# EAGLE design zloshnik2 (EAGLE 6.1)
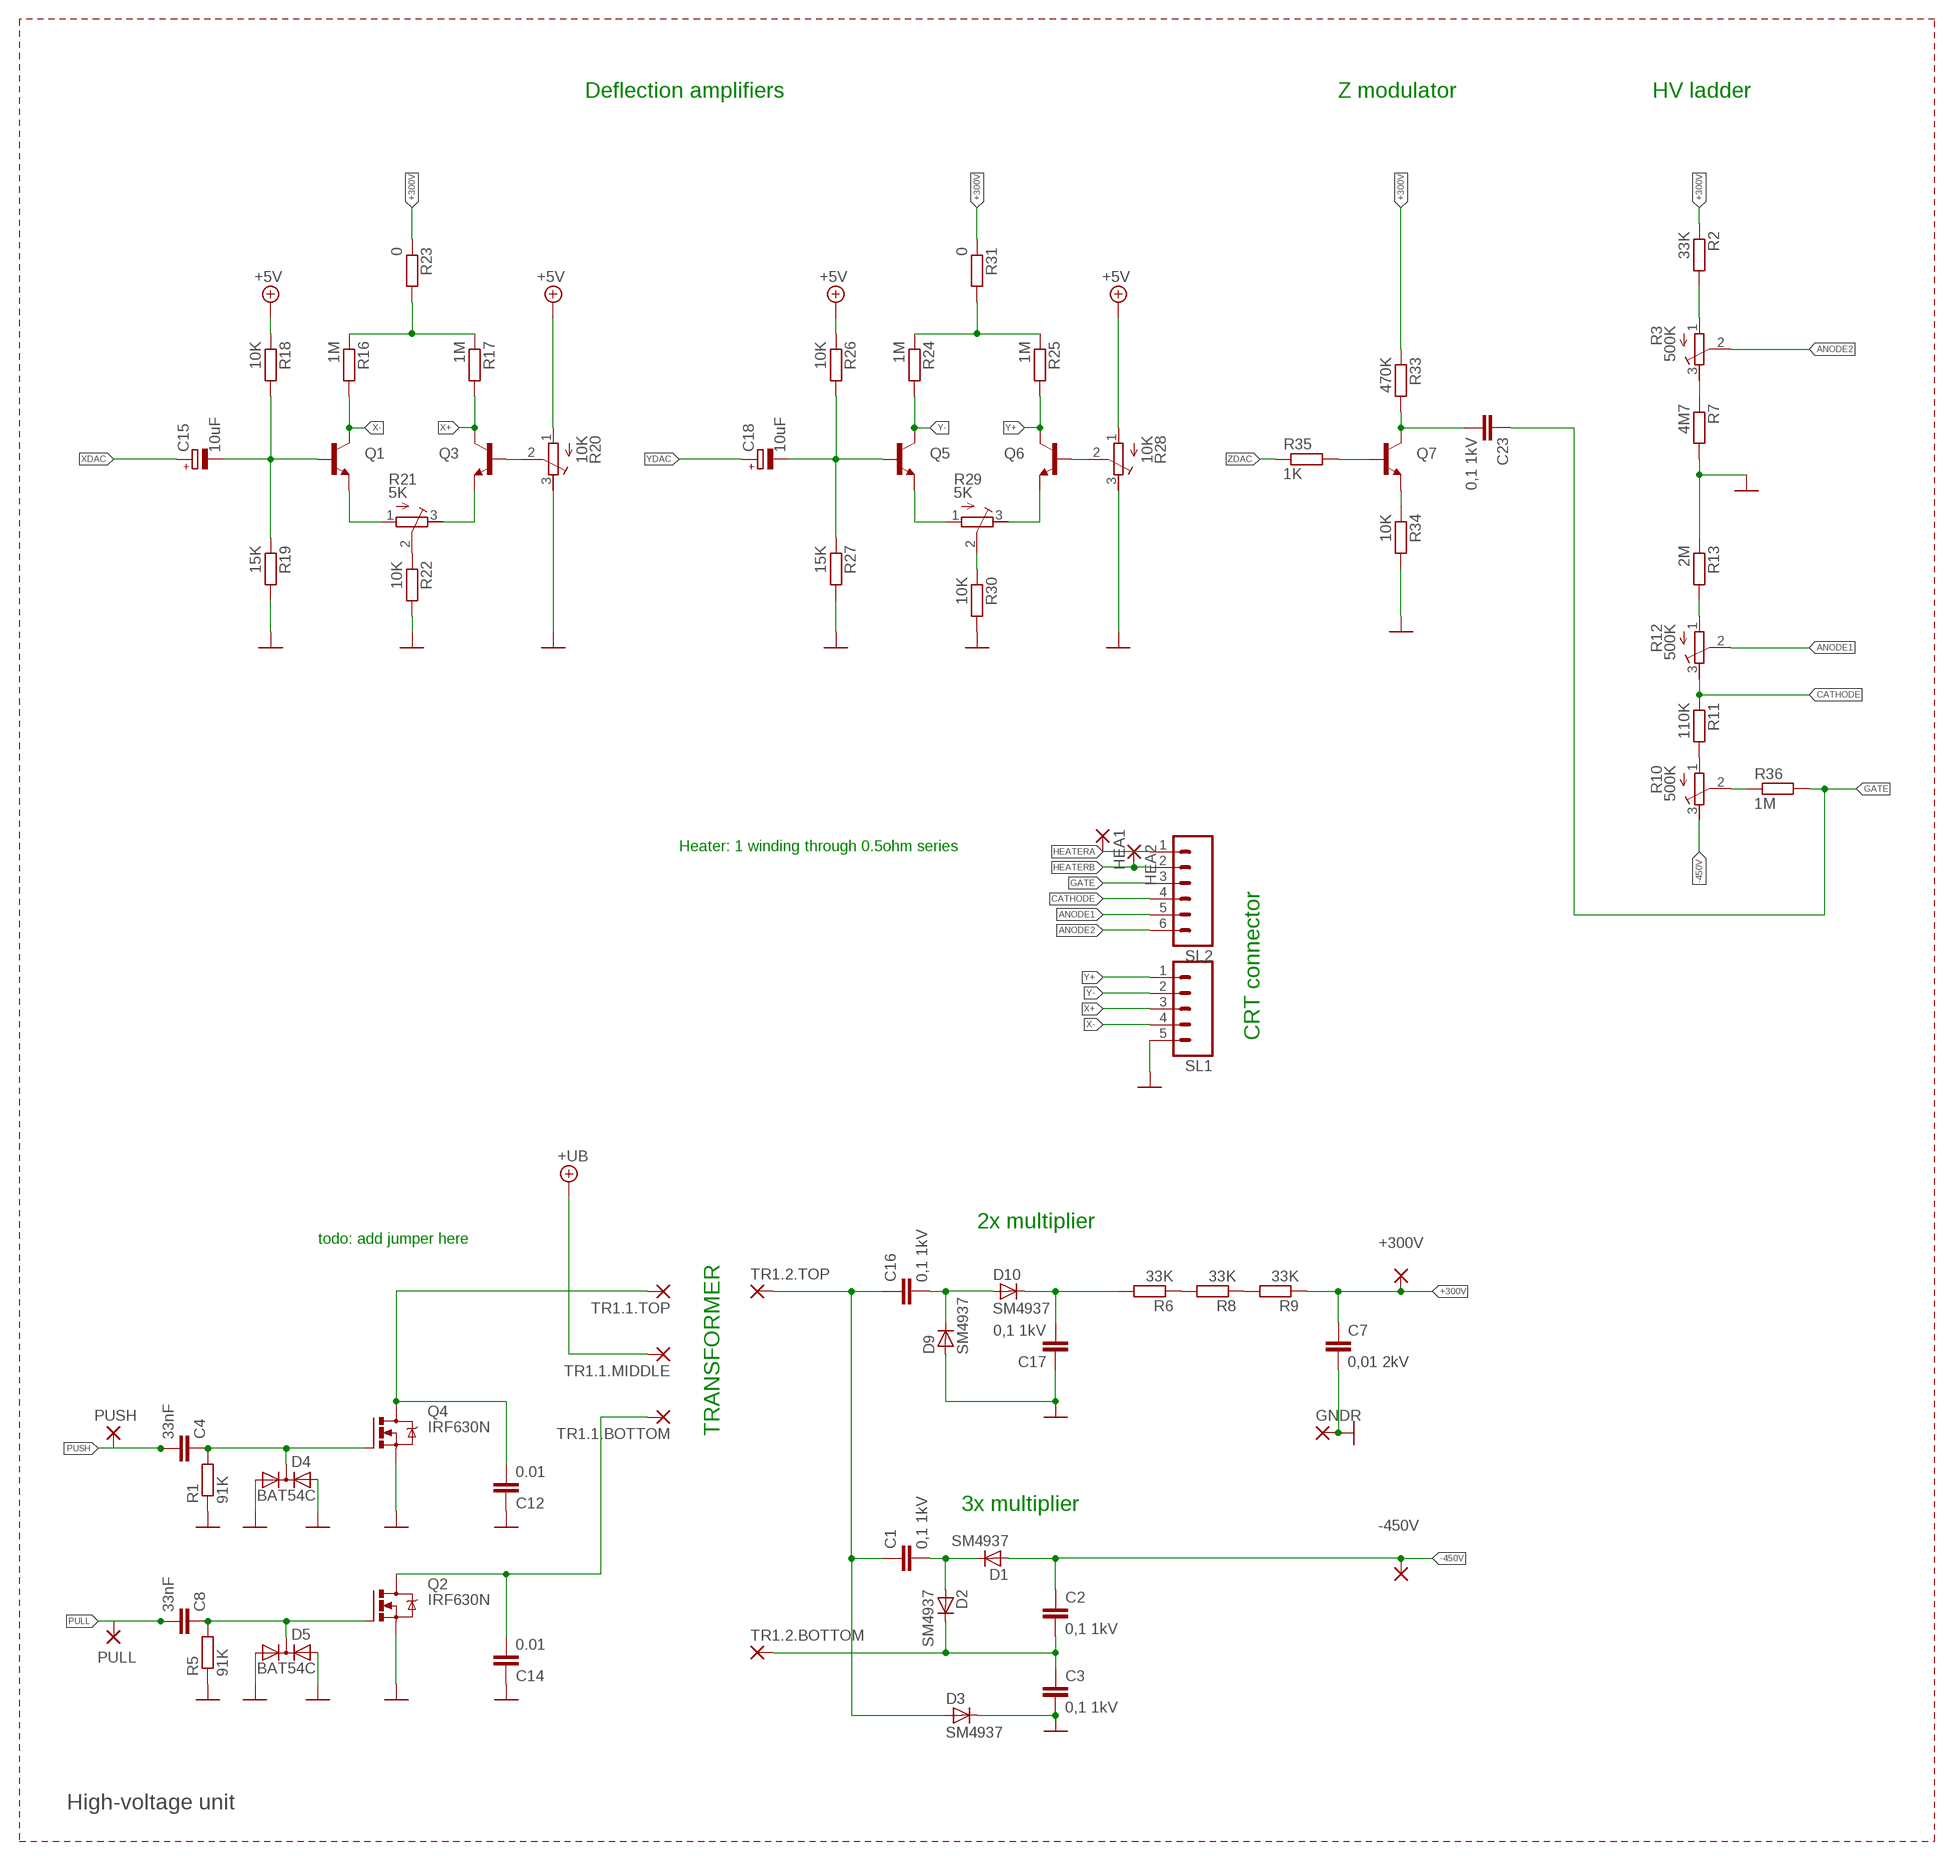
[diagram p0: schematic, sheet 1, part 1 of 2]
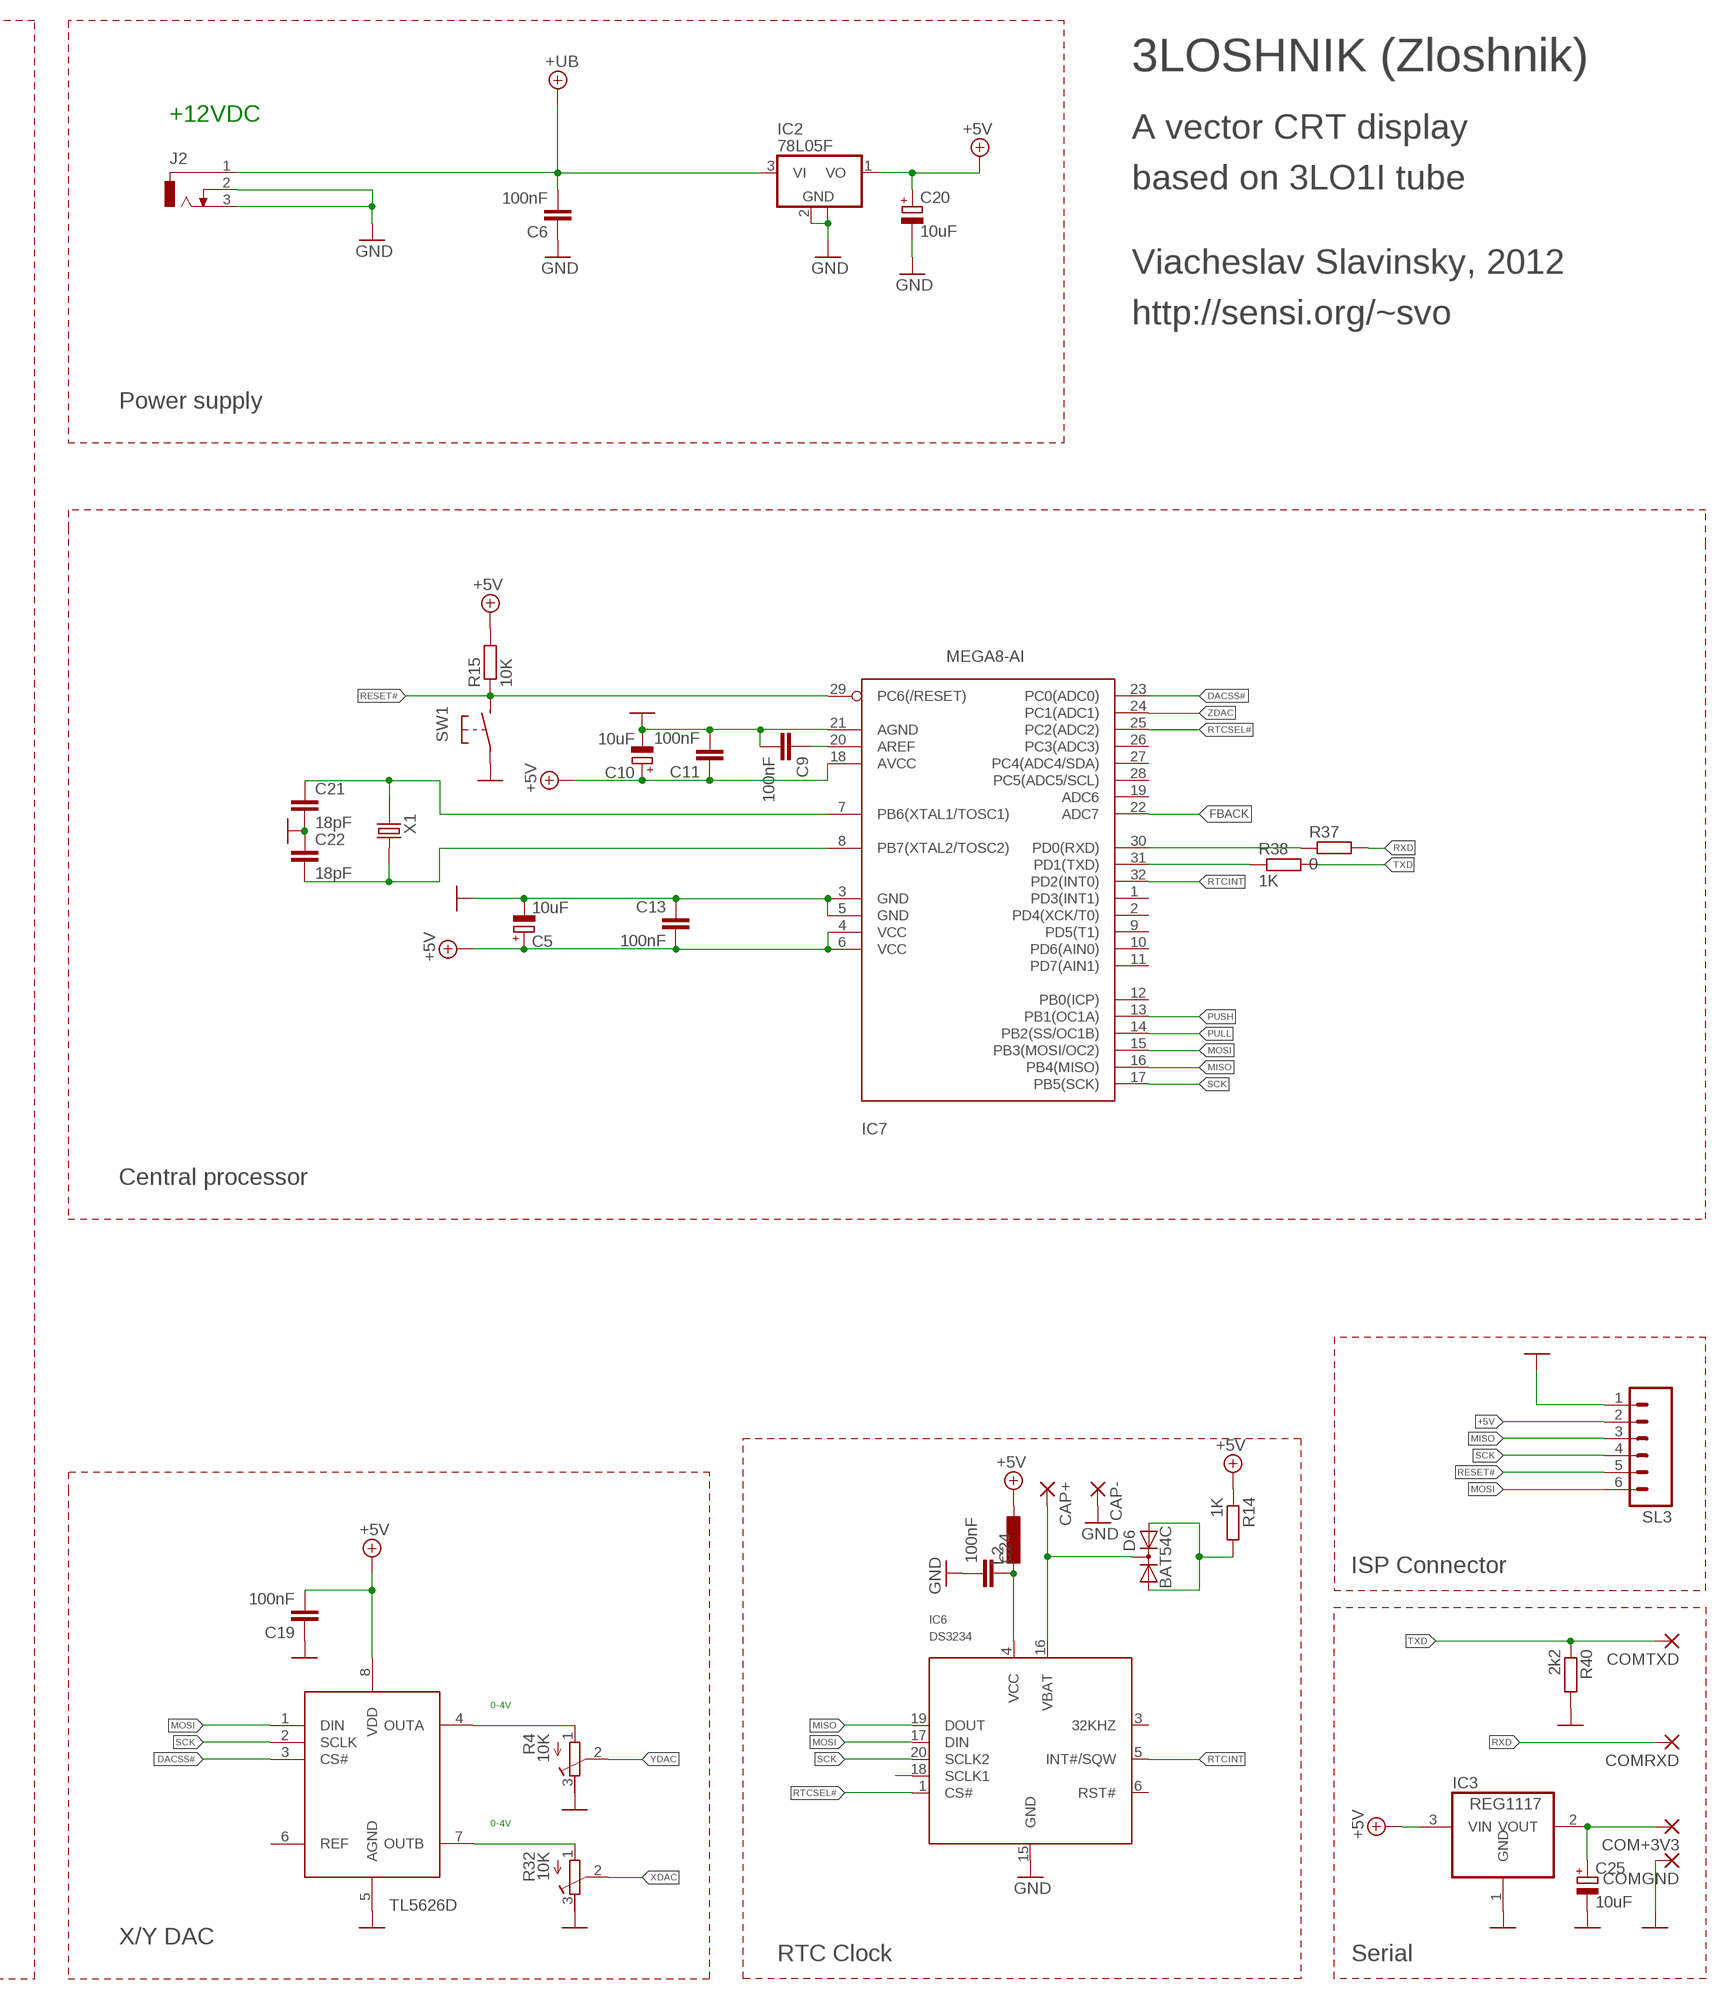
[diagram p1: schematic, sheet 1, part 2 of 2]

## Parts
+300V  1,6/0,8  [1,6/0,8]
-450V  1,6/0,8  [1,6/0,8]
C1  0,1 1kV  C-EUC2220K  [C2220K]
C2  0,1 1kV  C-EUC2220K  [C2220K]
C3  0,1 1kV  C-EUC2220K  [C2220K]
C4  33nF  C-EUC0805S  [C0805S]
C5  10uF  CPOL-EUSMCB  [SMC_B]
C6  100nF  C-EUC0603K  [C0603K]
C7  0,01 2kV  C-EUC1812  [C1812]
C8  33nF  C-EUC0805S  [C0805S]
C9  100nF  C-EUC0603K  [C0603K]
C10  10uF  CPOL-EUSMCB  [SMC_B]
C11  100nF  C-EUC0603K  [C0603K]
C12  0.01  C-EUC0805S  [C0805S]
C13  100nF  C-EUC0603K  [C0603K]
C14  0.01  C-EUC0805S  [C0805S]
C15  10uF  CPOL-EUSMCB  [SMC_B]
C16  0,1 1kV  C-EUC2220K  [C2220K]
C17  0,1 1kV  C-EUC2220K  [C2220K]
C18  10uF  CPOL-EUSMCB  [SMC_B]
C19  100nF  C-EUC0603K  [C0603K]
C20  10uF  CPOL-EUSMCB  [SMC_B]
C21  18pF  C-EUC0805S  [C0805S]
C22  18pF  C-EUC0805S  [C0805S]
C23  0,1 1kV  C-EUC2220K  [C2220K]
C24  100nF  C-EUC0603K  [C0603K]
C25  10uF  CPOL-EUSMCB  [SMC_B]
CAP+  2,54/0,8  [2,54/0,8]
CAP-  2,54/0,8  [2,54/0,8]
COM+3V3  1,6/0,8  [1,6/0,8]
COMGND  1,6/0,8  [1,6/0,8]
COMRXD  1,6/0,8  [1,6/0,8]
COMTXD  1,6/0,8  [1,6/0,8]
D1  SM4937  D-SOD-87  [SOD87]
D2  SM4937  D-SOD-87  [SOD87]
D3  SM4937  D-SOD-87  [SOD87]
D4  BAT54C  DIODE-2AC|CASOT23  [SOT23]
D5  BAT54C  DIODE-2AC|CASOT23  [SOT23]
D6  BAT54C  DIODE-2AC|CASOT23  [SOT23]
D9  SM4937  D-SOD-87  [SOD87]
D10  SM4937  D-SOD-87  [SOD87]
GNDR  1,6/0,8  [1,6/0,8]
HEA1  1,6/0,8  [1,6/0,8]
HEA2  1,6/0,8  [1,6/0,8]
IC1  TLV5626D  TL5626D  [SO08]
IC2  78L05F  [SOT89]
IC3  REG1117  [SOT223]
IC6  DS3234  [SO-20DW]
IC7  MEGA8-AI  [TQFP32-08]
J2  DCJ-SMALL  [DCJ-SMALL]
L2  L-EUL3230M  [L3230M]
PULL  1,6/0,8  [1,6/0,8]
PUSH  1,6/0,8  [1,6/0,8]
Q1  TRANSISTOR_NPNSOT23-3  [SOT23-3]
Q2  IRF630N  IRF740  [TO220BV]
Q3  TRANSISTOR_NPNSOT23-3  [SOT23-3]
Q4  IRF630N  IRF740  [TO220BV]
Q5  TRANSISTOR_NPNSOT23-3  [SOT23-3]
Q6  TRANSISTOR_NPNSOT23-3  [SOT23-3]
Q7  TRANSISTOR_NPNSOT23-3  [SOT23-3]
R1  91K  R-EU_R0805S  [R0805-SVO]
R2  33K  R-EU_R0805S  [R0805-SVO]
R3  500K  R-TRIMM4G/J  [RTRIM4G/J]
R4  10K  R-TRIMM4G/J  [RTRIM4G/J]
R5  91K  R-EU_R0805S  [R0805-SVO]
R6  33K  R-EU_R0805S  [R0805-SVO]
R7  4M7  R-EU_R0805S  [R0805-SVO]
R8  33K  R-EU_R0805S  [R0805-SVO]
R9  33K  R-EU_R0805S  [R0805-SVO]
R10  500K  R-TRIMM4G/J  [RTRIM4G/J]
R11  110K  R-EU_R0805S  [R0805-SVO]
R12  500K  R-TRIMM4G/J  [RTRIM4G/J]
R13  2M  R-EU_R0805S  [R0805-SVO]
R14  1K  R-EU_R0805S  [R0805-SVO]
R15  10K  R-EU_R0805S  [R0805-SVO]
R16  1M  R-EU_R0805S  [R0805-SVO]
R17  1M  R-EU_R0805S  [R0805-SVO]
R18  10K  R-EU_R0805S  [R0805-SVO]
R19  15K  R-EU_R0805S  [R0805-SVO]
R20  10K  R-TRIMM4G/J  [RTRIM4G/J]
R21  5K  R-TRIMM4G/J  [RTRIM4G/J]
R22  10K  R-EU_R0805S  [R0805-SVO]
R23  0  R-EU_R0805S  [R0805-SVO]
R24  1M  R-EU_R0805S  [R0805-SVO]
R25  1M  R-EU_R0805S  [R0805-SVO]
R26  10K  R-EU_R0805S  [R0805-SVO]
R27  15K  R-EU_R0805S  [R0805-SVO]
R28  10K  R-TRIMM4G/J  [RTRIM4G/J]
R29  5K  R-TRIMM4G/J  [RTRIM4G/J]
R30  10K  R-EU_R0805S  [R0805-SVO]
R31  0  R-EU_R0805S  [R0805-SVO]
R32  10K  R-TRIMM4G/J  [RTRIM4G/J]
R33  470K  R-EU_R0805S  [R0805-SVO]
R34  10K  R-EU_R0805S  [R0805-SVO]
R35  1K  R-EU_R0805S  [R0805-SVO]
R36  1M  R-EU_R0805S  [R0805-SVO]
R37  0  R-EU_R0805S  [R0805-SVO]
R38  1K  R-EU_R0805S  [R0805-SVO]
R40  2k2  R-EU_R0805S  [R0805-SVO]
SL1  M05  [05P]
SL2  M06  [06P]
SL3  M06  [06P]
SW1  BUTTON-IT_1181  [SW_IT1181]
TR1.1.BOTTOM  1,6/0,8  [1,6/0,8]
TR1.1.MIDDLE  1,6/0,8  [1,6/0,8]
TR1.1.TOP  1,6/0,8  [1,6/0,8]
TR1.2.BOTTOM  1,6/0,8  [1,6/0,8]
TR1.2.TOP  1,6/0,8  [1,6/0,8]
X1  XTAL0532  [XTAL_0532]

## Nets
+3V3: C25.+ COM+3V3.1(P) IC3.2(VOUT)
+5V: C5.+ C10.+ C11.1 C13.2 C19.2 C20.+ IC1.8(VDD) IC2.1(VO) IC3.3(VIN) IC7.4(VCC) IC7.6(VCC) IC7.18(AVCC) L2.1 R14.1 R15.2 R18.1 R20.1(E) R26.1 R28.1(E) SL3.2
+300V [hv250]: +300V.1(P) C7.1 R2.1 R9.1 R23.1 R31.1 R33.1
+UB [12v]: C6.2 IC2.3(VI) J2.1 TR1.1.MIDDLE.1(P)
-450V [hv800]: -450V.1(P) C2.1 D1.2(A) R10.3(A)
AC_A [hv800]: C1.1 C16.1 D3.2(A) TR1.2.TOP.1(P)
AC_B [hv800]: C2.2 C3.1 D2.1(C) TR1.2.BOTTOM.1(P)
ANODE1 [hv800]: R12.2(S) SL2.5
ANODE2 [hv800]: R3.2(S) SL2.6
CATHODE [hv800]: R11.1 R12.3(A) SL2.4
DACSS#: IC1.3(CS#) IC7.23(PC0(ADC0))
FBACK: IC7.22(ADC7)
GATE [hv800]: C23.1 R36.2 SL2.3
GND: C3.2 C5.- C6.1 C7.2 C9.2 C10.- C11.2 C12.1 C13.1 C14.1 C17.1 C19.1 C20.- C21.2 C22.1 C24.2 C25.- CAP-.1(P) COMGND.1(P) D3.1(C) D4.1(A1) D4.2(A2) D5.1(A1) D5.2(A2) D9.2(A) GNDR.1(P) IC1.5(AGND) IC2.2(GND) IC2.2@1(GND) IC3.1(GND) IC6.15(GND) IC7.3(GND) IC7.5(GND) IC7.21(AGND) J2.2 J2.3 Q2.S Q4.S R1.1 R4.3(A) R5.1 R7.2 R13.1 R19.2 R20.3(A) R22.2 R27.2 R28.3(A) R30.2 R32.3(A) R34.2 R40.2 SL1.5 SL3.1 SW1.P$1(P1)
HEATERA [hv800]: HEA1.1(P) SL2.1
HEATERB [hv800]: HEA2.1(P) SL2.2
HV+300UNF [hv800]: C17.2 D10.1(C) R6.2
HVN$3 [hv800]: C1.2 D1.1(C) D2.2(A)
HVN$6 [hv800]: C16.2 D9.1(C) D10.2(A)
HVN$17: R21.2(S) R22.1
HVN$18: Q1.2(E) R21.1(E)
HVN$19: Q3.2(E) R21.3(A)
HVN$21: R29.2(S) R30.1
HVN$22: R16.1 R17.1 R23.2
HVN$25: Q5.2(E) R29.1(E)
HVN$26: Q6.2(E) R29.3(A)
HVN$27: R24.1 R25.1 R31.2
MISO: IC6.19(DOUT) IC7.16(PB4(MISO)) SL3.3
MOSI: IC1.1(DIN) IC6.17(DIN) IC7.15(PB3(MOSI/OC2)) SL3.6
N$1 [hv800]: R2.2 R3.1(E)
N$2: IC6.18(SCLK1)
N$4: C4.1 D4.3(C) Q4.G R1.2
N$5: CAP+.1(P) D6.3(C) IC6.16(VBAT)
N$6 [hv800]: R3.3(A) R7.1
N$7: C8.1 D5.3(C) Q2.G R5.2
N$8: IC7.30(PD0(RXD)) R37.1
N$9 [hv800]: R12.1(E) R13.2
N$10: D6.1(A1) D6.2(A2) R14.2
N$12 [hv800]: R10.1(E) R11.2
N$14: C9.1 IC7.20(AREF)
N$20: IC7.31(PD1(TXD)) R38.1
N$23: Q3.1(B) R20.2(S)
N$24: C15.- Q1.1(B) R18.2 R19.1
N$28: Q6.1(B) R28.2(S)
N$29: C18.- Q5.1(B) R26.2 R27.1
N$30: C21.1 IC7.7(PB6(XTAL1/TOSC1)) X1.2
N$31: IC1.4(OUTA) R4.1(E)
N$32: IC1.7(OUTB) R32.1(E)
N$33: C22.2 IC7.8(PB7(XTAL2/TOSC2)) X1.4
N$34 [hv250]: C23.2 Q7.3(C) R33.2
N$35: Q7.2(E) R34.1
N$37 [hv800]: R10.2(S) R36.1
NVN$9 [hv800]: R8.1 R9.2
NVN$11 [hv800]: R6.1 R8.2
PULL: C8.2 IC7.14(PB2(SS/OC1B)) PULL.1(P)
PUSH: C4.2 IC7.13(PB1(OC1A)) PUSH.1(P)
RESET#: IC7.29(PC6(/RESET)) R15.1 SL3.5 SW1.P$2(P2)
RTCINT: IC6.5(INT#/SQW) IC7.32(PD2(INT0))
RTCSEL#: IC6.1(CS#) IC7.25(PC2(ADC2))
RTCVCC: C24.1 IC6.4(VCC) L2.2
RXD: COMRXD.1(P) R37.2
SCK: IC1.2(SCLK) IC6.20(SCLK2) IC7.17(PB5(SCK)) SL3.4
SW_LOW_A: C14.2 Q2.D TR1.1.BOTTOM.1(P)
SW_LOW_B: C12.2 Q4.D TR1.1.TOP.1(P)
TXD: COMTXD.1(P) R38.2 R40.1
X+ [hv250]: Q3.3(C) R17.2 SL1.3
X- [hv250]: Q1.3(C) R16.2 SL1.4
XDAC: C15.+ R32.2(S)
Y+ [hv250]: Q6.3(C) R25.2 SL1.1
Y- [hv250]: Q5.3(C) R24.2 SL1.2
YDAC: C18.+ R4.2(S)
ZDAC: IC7.24(PC1(ADC1)) R35.1
ZDACN$36: Q7.1(B) R35.2
Unconnected: IC1.6(REF) IC6.3(32KHZ) IC6.6(RST#) IC7.1(PD3(INT1)) IC7.2(PD4(XCK/T0)) IC7.9(PD5(T1)) IC7.10(PD6(AIN0)) IC7.11(PD7(AIN1)) IC7.12(PB0(ICP)) IC7.19(ADC6) IC7.26(PC3(ADC3)) IC7.27(PC4(ADC4/SDA)) IC7.28(PC5(ADC5/SCL))

## Notes on the sheet
- 3LOSHNIK (Zloshnik)
- Deflection amplifiers | Z modulator | HV ladder
- +12VDC
- A vector CRT display
- based on 3LO1I tube
- Viacheslav Slavinsky, 2012
- http://sensi.org/~svo
- Power supply
- Heater: 1 winding through 0.5ohm series
- CRT connector
- Central processor
- 2x multiplier
- todo: add jumper here
- TRANSFORMER
- ISP Connector
- 3x multiplier
- 0-4V
- 0-4V
- TL5626D
- High-voltage unit | X/Y DAC
- RTC Clock | Serial

## Library data of the parts
+300V -450V COM+3V3 COMGND COMRXD COMTXD GNDR HEA1 HEA2 PULL PUSH TR1.1.BOTTOM TR1.1.MIDDLE TR1.1.TOP TR1.2.BOTTOM TR1.2.TOP = wirepad:1,6/0,8: THROUGH-HOLE PAD
C1-C3 C7 C16 C17 C23 = 0-rcl:C-EU: CAPACITOR, European symbol
C4 C6 C8 C9 C11-C14 C19 C21 C22 C24 = rcl:C-EU: CAPACITOR, European symbol
C5 C10 C15 C18 C20 C25 = rcl:CPOL-EU: POLARIZED CAPACITOR, European symbol
CAP+ CAP- = wirepad:2,54/0,8: THROUGH-HOLE PAD
D1-D3 D9 D10 = semicon-smd-ipc:D-: DIODE unfilled
D4-D6 = diode:DIODE-2AC|CA: Dual DIODE Anode-Cathode|Cathode-Anode
IC1 = 0-tlv5626:TL5626*: 2.7-V TO 5.5-V LOW-POWER DUAL 8-BIT DIGITAL-TO-ANALOG CONVERTER WITH INTERNAL REFERENCE AND POWER DOWN ￼The TLV5626 is a dual 8-bit voltage output DAC with a flexible 3-wire serial interface.The serial interface allows glueless interface to TMS320 and SPI, QSPI, and Microwire serial ports. It is programmed with a 16-bit serial string containing 2 control and 8 data bits. The resistor string output voltage is buffered by a x2 gain rail-to-rail output buffer. The buffer features a Class AB output stage to improve stability and reduce settling time. The programmable settling time of the DAC allows the designer to optimize speed versus power dissipation. With its on-chip programmable precision voltage reference, the TLV5626 simplifies overall system design. Because of its ability to source up to 1 mA, the reference can also be used as a system reference. Implemented with a CMOS process, the device is designed for single supply operation from 2.7 V to 5.5 V. It is available in an 8-pin SOIC package to reduce board space in standard commercial and industrial temperature ranges.
IC2 = linear:78L*: POSITOIV-VOLTAGE REGULATORS Output up to 100 mA Source: http://focus.ti.com/lit/ds/symlink/ua78l05.pdf
IC3 = burr-brown:REG1117: 800mA and 1A Low Dropout (LDO) Positive Regulator 1.8V, 2.5V, 2.85V, 3.3V, 5V, and Adj; MPN: REG1117; OC_FARNELL: 1097566; OC_NEWARK: 14P6981
IC6 = 0-ds3234:DS3234*: Extremely Accurate SPI Bus RTC with Integrated Crystal and SRAM The DS3234 is a low-cost, extremely accurate SPI? bus real-time clock (RTC) with an integrated temperature-com- pensated crystal oscillator (TCXO) and crystal. The DS3234 incorporates a precision, temperature-compen- sated voltage reference and comparator circuit to monitor VCC. When VCCdrops below the power-fail voltage (VPF), the device asserts the RSToutput and also disables read and write access to the part when VCCdrops below both VPFand VBAT. The RSTpin is monitored as a pushbutton input for generating a µP reset. The device switches to the backup supply input and maintains accurate timekeeping when main power to the device is interrupted. The integra- tion of the crystal resonator enhances the long-term accu- racy of the device as well as reduces the piece-part count in a manufacturing line. The DS3234 is available in com- mercial and industrial temperature ranges, and is offered in an industry-standard 300-mil, 20-pin SO package. The DS3234 also integrates 256 bytes of battery-backed SRAM. In the event of main power loss, the contents of the memory are maintained by the power source con- nected to the VBATpin. The RTC maintains seconds, minutes, hours, day, date, month, and year information. The date at the end of the month is automatically adjust- ed for months with fewer than 31 days, including correc- tions for leap year. The clock operates in either the 24-hour or 12-hour format with AM/PM indicator. Two programmable time-of-day alarms and a programmable square-wave output are provided. Address and data are transferred serially by an SPI bidirectional bus. Accuracy ±2ppm from 0°C to +40°C Accuracy ±3.5ppm from -40°C to +85°C Battery Backup Input for Continuous Timekeeping Operating Temperature Ranges Commercial: 0°C to +70°C Industrial: -40°C to +85°C Low-Power Consumption Real-Time Clock Counts Seconds, Minutes, Hours, Day, Date, Month, and Year with Leap Year Compensation Valid Up to 2099 Two Time-of-Day Alarms Programmable Square-Wave Output 4MHz SPI Bus Supports Modes 1 and 3 Digital Temp Sensor Output: ±3°C Accuracy Register for Aging Trim RSTInput/Output 300-Mil, 20-Pin SO Package Underwriters Laboratories (UL®) Recognized
IC7 = atmel:MEGA8: MICROCONTROLLER 8 Kbytes FLASH, 1 kbytes SRAM, 512 bytes EEPROM, USART, 6-channel 10 bit ADC, 2-channel 8 bit ADC Pin compatible with Atmega48, ATMega88, ATMega168 Source: avr.lbr
J2 = 0-svo:DCJ-SMALL: Smaller DC power jack
L2 = rcl:L-EU: INDUCTOR, European symbol
Q1 Q3 Q5-Q7 = SparkFun:TRANSISTOR_NPN: Transistor NPN BJT configuration in SOT23 package. MMBT2222 is the common NPN we use. Double check BCE configuration again layout.
Q2 Q4 = transistor-power:IRF740: N-CHANNEL MOS FET
R1 R2 R5-R9 R11 R13-R19 R22-R27 R30 R31 R33-R38 R40 = rcl:R-EU_: RESISTOR, European symbol
R3 R4 R10 R12 R20 R21 R28 R29 R32 = 0-rcl:R-TRIMM: Trimm resistor
SL1 = con-amp-quick:M05: AMP QUICK CONNECTOR; OC_FARNELL: unknown; OC_NEWARK: unknown
SL2 SL3 = con-amp-quick:M06: AMP QUICK CONNECTOR
SW1 = 0-svo:BUTTON-IT_1181
X1 = 0-svo:XTAL0532: SMD Type 0532 (5x3.2mm) XTAL

## Net classes
1 5v: width 0.3 mm
2 12v: width 0.5 mm
3 hv250: width 0.25 mm, clearance 0.45 mm
4 hv800: width 0.25 mm, clearance 0.65 mm

## Board
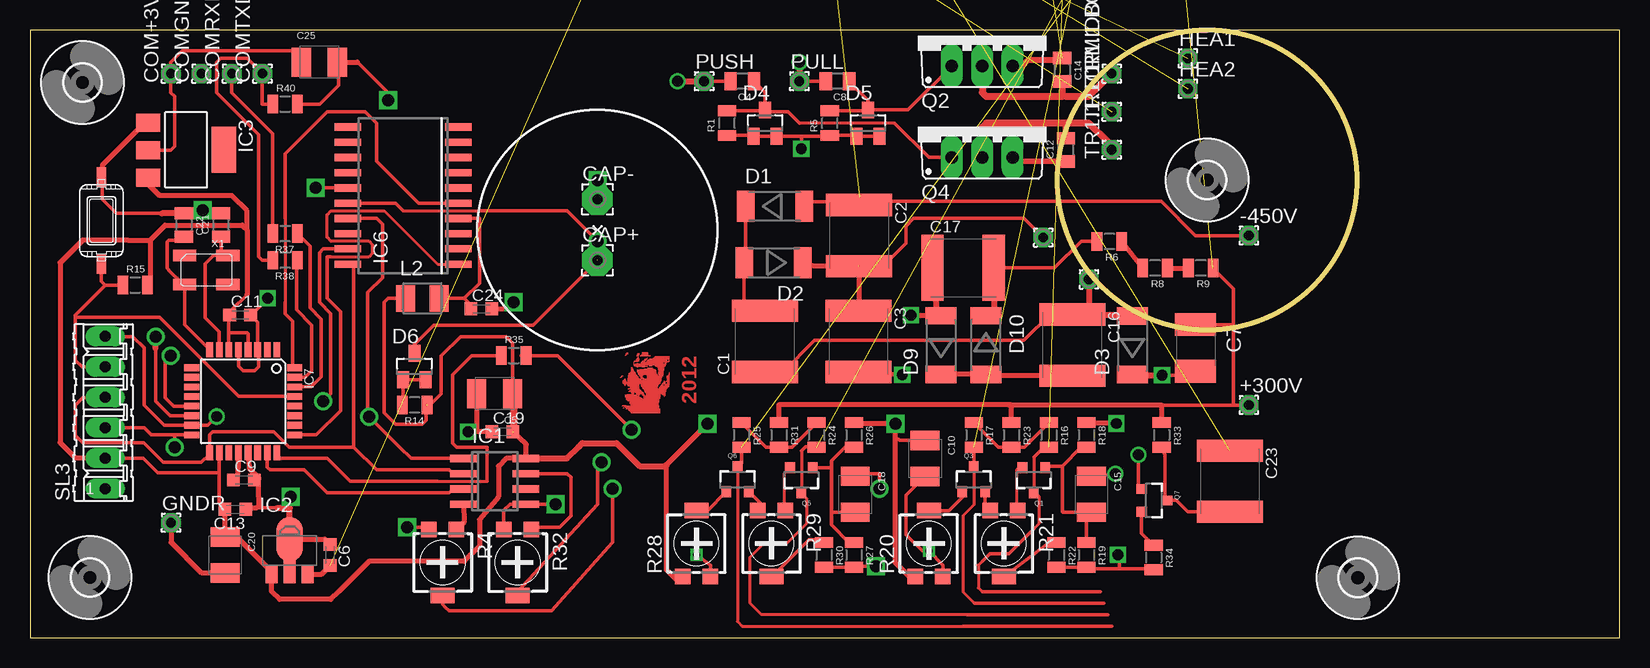
[diagram p2: board, top side]
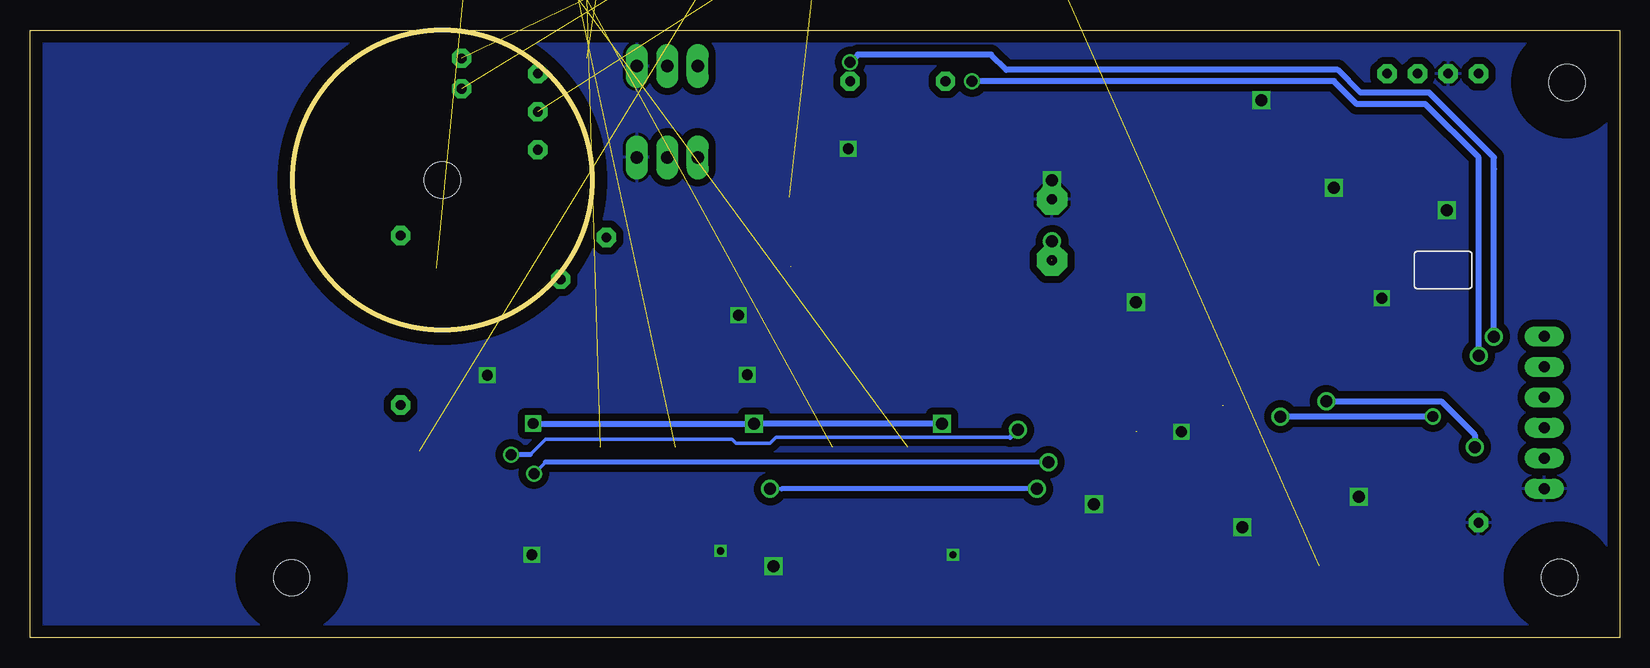
[diagram p3: board, bottom side, seen from below]

Size 132.5 x 50.62 mm. Coordinates in mm from the lower left corner, seen from the top.
Outline: 0,0 132.5,0 132.5,50.62 0,50.62 0,0
Outline: circle at 98.12,38.12 radius 12.5
Copper layers (1*16): Top 0.035mm / dielectric 1.5mm / Bottom 0.035mm
Design rules: minimum track width 10mil, minimum drill 24mil, track to track 8mil, track to pad 8mil, pad to pad 8mil, via to via 8mil, smd to smd 8mil, copper to edge 40mil, drill to drill 8mil, minimum pad ring 10mil, minimum via ring 8mil, stop-mask expansion 4mil, vias tented up to drill 0mil, thermal gap 10mil

### Footprints (pad centres in the part's own frame; a part is rotated, then mirrored left to right if it is on the bottom)
1,6/0,8 = drill 0.813 pad 1.6 octagon: 1 0,0
C2220K = smd 1.85 x 5.5: 1 -2.55,0; 2 2.55,0
C0805S = smd 1.016 x 1.524: 1 -0.977,0; 2 0.977,0
SMC_B = smd 1.6 x 2.4: + -1.5,0; - 1.5,0
C0603K = smd 1.05 x 1.08: 1 -0.875,0; 2 0.875,0
C1812 = smd 1.9 x 3.4: 1 -1.95,0; 2 1.95,0
2,54/0,8 = drill 0.813 pad 2.54 octagon: 1 0,0
SOD87 = smd 1.45 x 2.6: 1 -2.445,0; 2 2.445,0
SOT23 = smd 1 x 1.4: 1 -0.95,-1.1; 2 0.95,-1.1; 3 0,1.1
SO08 = smd 0.6 x 2.2: 1 -1.905,-2.6; 2 -0.635,-2.6; 3 0.635,-2.6; 4 1.905,-2.6; 5 1.905,2.6; 6 0.635,2.6; 7 -0.635,2.6; 8 -1.905,2.6
SOT89 = smd 1 x 1.5: 1 -1.499,-1.981; 3 1.499,-1.981 | smd 1 x 2: 2 0,-1.727 | smd 2.2 x 3.7: 2@1 0,0.94
SOT223 = smd 1.499 x 2.007: 1 -2.261,-3.15; 2 0.025,-3.15; 3 2.311,-3.15 | smd 3.81 x 2.007: 4 0,3.15
SO-20DW = smd 0.6 x 2.2: 1 -5.715,-4.6; 2 -4.445,-4.6; 3 -3.175,-4.6; 4 -1.905,-4.6; 5 -0.635,-4.6; 6 0.635,-4.6; 7 1.905,-4.6; 8 3.175,-4.6; 9 4.445,-4.6; 10 5.715,-4.6; 11 5.715,4.6; 12 4.445,4.6; 13 3.175,4.6; 14 1.905,4.6; 15 0.635,4.6; 16 -0.635,4.6; 17 -1.905,4.6; 18 -3.175,4.6; 19 -4.445,4.6; 20 -5.715,4.6
TQFP32-08 = smd 1.27 x 0.559: 1 -4.293,2.8; 2 -4.293,2; 3 -4.293,1.2; 4 -4.293,0.4; 5 -4.293,-0.4; 6 -4.293,-1.2; 7 -4.293,-2; 8 -4.293,-2.8; 17 4.293,-2.8; 18 4.293,-2; 19 4.293,-1.2; 20 4.293,-0.4; 21 4.293,0.4; 22 4.293,1.2; 23 4.293,2; 24 4.293,2.8 | smd 0.559 x 1.27: 9 -2.8,-4.293; 10 -2,-4.293; 11 -1.2,-4.293; 12 -0.4,-4.293; 13 0.4,-4.293; 14 1.2,-4.293; 15 2,-4.293; 16 2.8,-4.293; 25 2.8,4.293; 26 2,4.293; 27 1.2,4.293; 28 0.4,4.293; 29 -0.4,4.293; 30 -1.2,4.293; 31 -2,4.293; 32 -2.8,4.293
DCJ-SMALL = drill 1 pad 2.184: 1 0,3; 2 3,0; 3 0,-2
L3230M = smd 1.6 x 2.2: 1 -1.4,0; 2 1.4,0
SOT23-3 = smd 0.8 x 0.9: 1 -0.95,-1; 2 0.95,-1; 3 0,1.1
TO220BV = drill 1.016 long: D 0,-2.54; G -2.54,-2.54; S 2.54,-2.54
R0805-SVO = smd 0.9 x 1.524: 1 -1.027,0; 2 1.027,0
RTRIM4G/J = smd 1.3 x 1.3: 1 -1.15,-2.75; 3 1.15,-2.75 | smd 2 x 1.3: 2 0,2.75
05P = drill 0.914 long: 1 -5.08,0; 2 -2.54,0; 3 0,0; 4 2.54,0; 5 5.08,0
06P = drill 0.914 long: 1 -6.35,0; 2 -3.81,0; 3 -1.27,0; 4 1.27,0; 5 3.81,0; 6 6.35,0
SW_IT1181 = smd 1.676 x 0.813: P$1 -3.61,0; P$2 3.61,0
3,0 = hole 3: 0,0
XTAL_0532 = smd 1.93 x 0.965: 1 1.8,-1.2; 2 -1.8,-1.2; 3 -1.8,1.2; 4 1.8,1.2

### Placement (x,y rotation side)
+300V  101.6,19.37 0 top
-450V  101.6,33.5 0 top
C1  61.25,24.67 90 top
C2  69.12,33.49 270 top
C3  69.07,24.68 270 top
C4  59.37,46.35 180 top
C5  38.73,20.32 180 top
C6  25.02,6.88 270 top
C7  97.16,24.13 270 top
C8  67.31,46.35 180 top
C9  17.83,13.12 0 top
C10  74.61,14.92 270 top
C11  17.52,26.88 0 top
C12  86.36,40.64 90 top
C13  17.12,10.68 180 top
C14  86.04,47.31 270 top
C15  88.47,11.93 270 top
C16  86.88,24.36 270 top
C17  77.79,30.8 0 top
C18  68.8,11.93 270 top
C19  39.37,17.14 0 top
C20  16.27,6.88 270 top
C21  15.94,34.38 90 top
C22  12.83,34.38 270 top
C23  100.01,13.02 270 top
C24  37.62,27.38 0 top
C25  24.13,47.94 0 top
CAP+  47.31,31.43 0 top
CAP-  47.31,36.51 0 top
COM+3V3  11.75,46.99 90 top
COMGND  14.29,46.99 90 top
COMRXD  16.83,46.99 90 top
COMTXD  19.37,46.99 90 top
D1  62.11,35.93 0 top
D2  61.98,31.23 180 top
D3  91.89,24.36 90 top
D4  61.28,42.86 0 top
D5  69.85,42.86 0 top
D6  32.05,22.59 0 top
D9  75.94,24.36 90 top
D10  79.69,24.36 270 top
GNDR  11.76,9.56 0 top
HEA1  96.52,48.26 0 top
HEA2  96.52,45.72 0 top
IC1  TL5626D  [SO08]  38.73,13.02 270 top
IC2  21.65,7.26 0 top
IC3  13.02,40.64 270 top
IC6  31.11,36.83 90 top
IC7  17.78,19.68 270 top
J2  52.48,70.92 180 top  (outside the outline)
L2  32.7,28.26 0 top
PULL  64.14,46.35 0 top
PUSH  56.2,46.35 0 top
Q1  83.68,13.13 180 top
Q2  79.38,50.16 0 top
Q3  78.67,13.13 0 top
Q4  79.38,42.55 0 top
Q5  64.31,13.13 180 top
Q6  58.98,13.13 0 top
Q7  93.66,11.43 270 top
R1  58.1,42.86 90 top
R2  94.62,72.34 90 top  (outside the outline)
R3  89.85,72.39 180 top  (outside the outline)
R4  34.4,6.25 180 top
R5  66.67,42.86 90 top
R6  89.97,33.01 180 top
R7  85.09,73.55 270 top  (outside the outline)
R8  93.78,30.79 180 top
R9  97.59,30.79 180 top
R10  66.01,72.29 180 top  (outside the outline)
R11  70.93,74.93 180 top  (outside the outline)
R12  76.2,72.39 180 top  (outside the outline)
R13  81.59,73.62 90 top  (outside the outline)
R14  32.07,19.37 180 top
R15  8.77,29.38 0 top
R16  2M2  [R0805-SVO]  84.93,16.89 270 top
R17  4M7  [R0805-SVO]  78.68,16.89 270 top
R18  88.06,16.89 270 top
R19  88.06,6.88 270 top
R20  74.93,7.83 0 top
R21  500K  [RTRIM4G/J]  81.18,7.83 180 top
R22  33K  [R0805-SVO]  85.56,6.88 270 top
R23  81.81,16.89 270 top
R24  2M2  [R0805-SVO]  65.56,16.89 270 top
R25  4M7  [R0805-SVO]  59.3,16.89 270 top
R26  68.68,16.89 270 top
R27  68.68,6.88 270 top
R28  55.55,7.83 0 top
R29  500K  [RTRIM4G/J]  61.8,7.83 180 top
R30  33K  [R0805-SVO]  66.18,6.88 270 top
R31  62.43,16.89 270 top
R32  40.65,6.25 180 top
R33  2M2  [R0805-SVO]  94.34,16.89 270 top
R34  75-100K  [R0805-SVO]  93.66,6.67 270 top
R35  40.32,23.5 0 top
R36  70.8,70.2 270 top  (outside the outline)
R37  21.27,33.66 180 top
R38  21.27,31.43 180 top
R40  21.27,44.45 0 top
SL1  88.9,63.02 180 top  (outside the outline)
SL2  72.39,62.87 0 top  (outside the outline)
SL3  6.27,18.75 90 top
SW1  5.96,34.74 270 top
TR1.1.BOTTOM  90.17,46.99 90 top
TR1.1.MIDDLE  90.17,43.81 90 top
TR1.1.TOP  90.17,40.64 90 top
TR1.2.BOTTOM  84.45,33.34 90 top
TR1.2.TOP  88.27,29.84 90 top
U$1  [3,0]  110.69,4.98 0 top
U$2  [3,0]  98.12,38.12 0 top
U$3  [3,0]  5,5 0 top
U$4  [3,0]  4.38,46.25 0 top
X1  14.7,30.62 180 top

### Tracks (layer width: path | path; a pad name or v marks a point on that pad's centre or on a via)
+3V3
  Top 0.305: IC3.2 11.72,40.62 12.06,40.96 12.06,43.81 12.06,45.09 11.75,45.4 COM+3V3.1 11.75,47.94 12.7,48.9 21.91,48.9 22.63,48.17 C25.+
+5V  (via drill 0.9, 1)  (2 unrouted)
  Top 0.305: SL3.2 9.46,14.94 10.02,14.38 10.64,13.75 15.68,13.75 15.78,13.65 | IC7.6 16.58,25.4 | 16.58,25.4 16.58,26.81 C11.1 16.83,27.06 16.83,27.3 18.1,28.57 | IC7.4 18.18,25.32 18.1,25.4 16.58,25.4 | IC7.18 15.78,13.65 | 15.78,13.65 15.78,11.21 16.19,10.79 16.27,10.72 16.27,10.62 | C10.+ 72.48,16.42 72.39,16.51 72.11,16.55 72.11,16.59 | C5.+ 40.23,24.54 39.69,25.08 35.88,25.08 34.29,23.5 34.29,20.32 33.02,19.05 33.02,19.37 | L2.1 30.48,28.26 29.84,28.26 29.53,27.94 29.53,18.73 30.48,17.78 32.7,17.78 33.02,18.1 33.02,19.29 R14.1
  Top 0.406: R18.1 90.56,17.91 v90.56,17.83 | v72.13,17.84 v72.13,17.83 v72.13,17.84 | v72.13,17.84 72.13,17.82 68.9,17.82 R26.1 | v72.13,17.84 72.12,17.85 72.11,16.59 72.11,16.55 72.11,6.27 73.68,4.7 73.78,4.8 R20.1 | R28.1 53.93,4.76 53.05,5.63 53.05,14.38 v56.5,17.83 | C19.2 41.37,16.09 IC1.8 39.69,14.92 39.05,14.29 39.05,11.75 37.47,9.84 37.47,7.62 36.2,6.35 28.26,6.35 25.72,3.81 25.08,3.17 20.8,3.17 20.16,3.81 20.16,5.08 | C13.2 16.27,10.65 16.27,10.62 C20.+ 17.27,8.38 20.02,5.62 20.15,5.49 IC2.1 20,5.13 20.16,5.08 | SL3.2 6.21,15 3.77,15 2.52,16.25 2.52,31.25 4.39,33.12 8.14,33.12 10.02,33.12 | 10.02,33.12 11.27,34.38 17.7,34.38 17.78,34.29 17.83,34.24 18.1,33.97 | 10.02,33.12 10.02,29.38 R15.2 | 20.16,5.08 20.32,5.4 20.16,5.08 | 18.1,33.97 18.1,28.57 | 18.1,33.97 18.1,35.56 16.83,36.83 10.79,36.83 9.84,37.78 9.84,38.1 9.84,38.04 IC3.3
  Top 0.5: IC1.8 44.13,14.92 44.77,14.92 45.72,15.88 46.04,16.19 48.9,16.19 50.8,14.29 53.02,14.29 53.05,14.32 53.05,14.38
  Top 0.6: C5.+ 40.32,20.23 40.32,17.14
  Bottom 0.5: v90.56,17.83 v72.13,17.83 v56.5,17.83
+300V  (1 unrouted)
  Top 0.305: 100.33,26.04 100.33,19.37 | 100.33,19.37 94.34,19.37 94.34,19.32 | C7.1 100.33,26.08 100.33,26.04 | 100.33,19.37 +300V.1 | R9.1 100.33,29.07 100.33,26.04
  Top 0.406: R23.1 81.81,19.39 | 81.81,19.39 62.43,19.39 R31.1 | R33.1 94.34,19.32 94.3,19.37 81.6,19.37 81.61,19.39 81.81,19.39
+UB  (2 unrouted)
  Top 0.406: IC2.3 24.3,5.28 C6.2
-450V  (1 unrouted)
  Top 0.305: 71.44,36.35 91.76,36.35 94.3,36.35 97.16,33.5 -450V.1 | 68.69,36.3 65.19,36.3 64.77,35.88 64.72,35.93 D1.2 | -450V.1 101.76,33.5 101.6,33.66 -450V.1
  Top 0.406: 68.69,36.3 69.07,36.55 69.38,36.55 | C2.1 69.19,36.67 69.38,36.55 | 69.38,36.55 71.08,36.55 71.44,36.35
AC_A
  Top 0.305: C1.1 62.76,22.12 65.41,24.77 82.87,24.77 85.09,26.99 86.68,26.99 86.75,26.91 C16.1
  Top 0.406: 86.99,26.8 C16.1 86.92,26.86 88.27,26.86 88.75,26.86
  Top 0.5: D3.2 91.83,26.86 88.75,26.86 | TR1.2.TOP.1 88.27,26.86
AC_B  (1 unrouted)
  Top 0.305: TR1.2.BOTTOM.1 82.87,34.92 73.66,34.92 73.03,34.29 73.03,32.86 70.96,30.8 69.22,30.8 69.06,30.96
  Top 0.406: 68.75,27.49 68.81,27.49 C3.1 | 70.48,27.3 69.14,27.3 C3.1 | D2.1 65.36,30.94 C2.2 69.12,27.92 C3.1
ANODE1  (1 unrouted)
ANODE2  (1 unrouted)
CATHODE  (2 unrouted)
DACSS#
  Top 0.305: IC7.23 19.78,14.19 20,13.97 22.86,13.97 24.45,12.38 24.77,12.06 33.34,12.06 34.29,12.06 34.92,12.06 35.24,12.38 IC1.3 | IC1.3 36.2,12.38 IC1.3
GATE  (2 unrouted)
GND  (via drill 0.6, 0.9, 0.9 pad 1.1, 1, 1 pad 1.1)  (6 unrouted)
  Top 0.305: R22.2 86.81,5.86 R19.2 88.12,5.86 88.27,5.71 | R30.2 67.43,5.86 R27.2 68.76,5.94 v70.51,5.94 | R20.3 76.12,6.03 v74.94,7.21 74.39,7.21 73.03,8.57 73.03,11.84 C10.- | R28.3 56.75,6.03 v55.56,6.89 | C22.1 14.38,35.35 C21.2 | v19.81,28.27 18.72,27.14 18.41,26.99 18.39,26.97 C11.2 18.98,26.29 IC7.3 18.98,24.06 19.05,24.13 19.05,23.81 19.05,22.54 18.73,22.23 17.78,22.23 17.38,22.62 IC7.5 | R32.3 39.49,10.6 40.01,11.11 IC1.5 v43.81,11.11 | R4.3 33.23,9 33.02,9.21 v31.43,9.21 | IC6.15 25.4,37.47 v23.81,37.47 | R1.1 60.26,41.84 D4.1 D4.2 64.29,41.76 | 64.29,41.76 66.6,41.76 R5.1 68.83,41.84 D5.1 D5.2 | v64.3,40.73 64.3,41.76 64.29,41.76 | R34.2 93.66,5.71 90.81,5.71 | 90.81,5.71 90.49,5.71 | 90.49,5.71 88.27,5.71 | 88.27,5.71 87.95,5.71 88.27,6.03 87.95,6.03 | v94.38,21.86 97.16,21.86 C7.2 | 75.94,26.86 75.94,26.93 75.88,26.99 75.56,26.99 | 11,35.35 7.19,35.35 6.03,36.51 6.03,38.42 6.02,38.42 SW1.P$1 | R40.2 24.13,44.45 25.72,46.04 25.72,47.62 25.56,47.78 | 25.56,47.78 25.4,47.94 | 27.3,47.94 29.84,45.4 v29.84,44.77 | C25.- 25.63,47.85 25.56,47.78 | 20.64,10.79 18.1,10.79 | v90.67,6.89 90.81,6.89 90.81,5.71 | 90.81,5.71 90.49,5.71
  Top 0.406: C17.1 75.44,31.24 75.32,31.11 | D9.2 75.94,26.86 v73.44,26.86 | C13.1 18.09,10.68 18.09,10.79 18.1,10.79 18.89,10.79 19.05,10.95 19.05,11.75 19.05,13.1 C9.2 19.05,13.15 19.05,13.34 18.29,14.1 IC7.21 | IC2.2@1 21.65,5.87 21.89,5.62 | IC2.2@1 IC2.2 | IC2.2@1 24.57,8.2 C6.1 | v14.38,35.62 14.38,35.35 | C19.1 37.47,17.14 | 37.47,17.14 v36.51,17.14 | C5.- 37.23,17.38 37.47,17.14 | v72.71,21.91 68.9,21.96 C3.2 | IC3.1 9.25,42.58 6.03,39.37 6.03,38.42 6.02,38.42 | C25.- 27.3,47.94 | C24.2 39.76,27.38 v40.32,27.94 | GNDR.1 11.76,7.93 14.29,5.4 16.19,5.4 16.25,5.4 C20.-
  Top 0.5: C22.1 11,35.35 | 6.02,38.42 SW1.P$1 | C12.1 82.25,39.67 Q4.S | C14.1 85.86,48.1 83.19,48.1 82.71,47.62 Q2.S | D3.1 91.94,21.86 v94.38,21.86 | 75.32,31.11 75.56,26.99 | IC2.2@1 21.65,10.79 | 21.65,10.79 21.65,11.49 21.91,11.75 21.75,11.91 | 21.75,11.91 21.59,11.75 | 20.64,10.79 21.65,10.79 | 21.75,11.91 v21.75,11.75
  other vias: 47.31,38.1 83.5,71.12
  pour Bottom (isolate 0.6): -1.27,51.88 133.47,51.88 133.47,-1.27 -0.95,-1.27
HEATERA  (1 unrouted)
HEATERB  (1 unrouted)
HV+300UNF
  Top 0.305: C17.2 85.41,30.8 87.63,33.02 88.93,33.02 R6.2
  Top 0.5: C17.2 80.34,27.45 D10.1
HVN$3
  Top 0.305: D1.1 59.66,31.36 D2.2 59.54,27.45 59.69,27.3 61.17,27.3 C1.2
HVN$6
  Top 0.406: C16.2 79.8,21.82 D10.2 76,21.92 75.94,21.86 D9.1
HVN$17
  Top 0.305: R22.1 84.96,7.91 R21.2
HVN$18
  Top 0.25: Q1.2 82.4,14.13 82.23,13.97 82.23,10.79 82.33,10.7 R21.1
HVN$19
  Top 0.305: 80.25,10.18 R21.3 79.62,10.67 Q3.2
HVN$21
  Top 0.305: R29.2 61.8,5.01 64.93,8.13 65.96,8.13 R30.1
HVN$22
  Top 0.305: R17.1 80.73,15.86 R23.2 82.88,15.86 R16.1
HVN$25
  Top 0.25: Q5.2 63.35,14.13 62.87,13.65 62.87,10.48 | 62.87,10.48 63.18,10.48 | 63.35,10.66 63.04,10.66 R29.1 62.87,10.49 62.87,10.48
HVN$26
  Top 0.305: 60.88,10.48 R29.3 60.64,10.27 60.64,10.48 60.96,10.48 60.88,11.19 Q6.2
HVN$27
  Top 0.305: R25.1 61.36,15.86 R31.2 63.5,15.86 R24.1
MISO  (via drill 1)
  Top 0.305: IC7.16 12.06,16.89 | 12.06,16.89 10.1,16.89 9.53,17.46 6.35,17.46 6.29,17.46 SL3.3 | v12.06,15.88 12.06,16.83 12.06,16.89 | v24.45,19.68 25.08,20.32 25.08,26.99 24.13,27.94 24.13,32.07 24.45,32.38 25.08,32.38 25.4,32.38 26.35,32.38 IC6.19
  Bottom 0.5: v24.45,19.68 14.87,19.68 12.06,16.89 v12.06,15.88
MOSI  (via drill 0.9, 1)
  Top 0.305: SL3.6 6.29,25.08 8.57,25.08 9.53,24.13 9.53,19.37 11.21,17.68 IC7.15 14.83,17.68 15.24,18.1 v15.56,18.41 | IC1.1 31.75,14.92 30.8,15.88 v28.26,18.41 28.16,18.52 28.16,28.76 29.39,30 29.39,34.38 29.39,34.42 28.89,34.92 IC6.17
  Bottom 0.305: 27.84,18.41 27.62,18.41 27.84,18.41
  Bottom 0.5: v15.56,18.41 27.84,18.41
  Bottom 0.7: 27.84,18.41 v28.26,18.41
N$1  (1 unrouted)
N$4
  Top 0.25: 72.07,42.86 64.14,42.86
  Top 0.305: D4.3 61.28,45.43 C4.1 | R1.2 61.2,43.89 D4.3 | Q4.G 74.93,40.01 72.07,42.86 | 64.14,42.86 63.18,43.81 61.42,43.81 D4.3
N$5  (via drill 1)  (1 unrouted)
  Top 0.25: 31.11,35.56 37.47,35.56
  Top 0.305: IC6.16 30.48,36.2 31.11,35.56 | 47.31,33.34 v47.31,33.02 | v47.31,33.02 47.31,31.46 | D6.3 32.05,24.43 33.34,25.72 33.66,26.04 41.93,26.04 47.31,31.41 CAP+.1 | 37.47,35.56 44.77,35.56 v47.31,33.02
N$6  (1 unrouted)
N$7
  Top 0.305: R5.2 69.78,43.89 D5.3 | C8.1 68.29,46.33 69.85,44.77 D5.3 | D5.3 73.17,43.96 Q2.G
N$8
  Top 0.305: IC7.30 23.43,20.89 24.13,21.59 24.29,21.75 24.29,26.51 23.34,27.46 23.34,32.62 R37.1
N$9  (1 unrouted)
N$10
  Top 0.305: D6.2 D6.1 31.09,19.42 R14.2
N$12  (1 unrouted)
N$14
  Top 0.406: IC7.20 17.33,13.66 C9.1
N$20
  Top 0.305: IC7.31 22.95,21.68 23.5,22.23 23.5,22.54 23.5,26.04 22.23,27.3 22.23,31.43 R38.1
N$23
  Top 0.305: R20.2 76.62,10.58 77.79,11.75 77.79,12.06 77.79,12.07 Q3.1
N$24
  Top 0.25: 88.37,15.77 88.27,15.88 88.25,15.86 R18.2
  Top 0.305: R18.2 87.61,15.86 86.04,14.29 | 86.04,14.29 84.45,14.29 84.61,14.13 Q1.1 | C15.- 87.95,10.43 | 87.95,10.43 86.09,10.43 86.04,10.48 86.04,14.29 | R19.1 88.06,10.32 87.95,10.43
N$28
  Top 0.305: R28.2 56.47,10.58 Q6.1
N$29
  Top 0.305: Q5.1 66.81,14.13 | R27.1 68.28,7.91 66.81,9.38 66.81,10.48 | 66.81,10.48 66.81,14.13 | C18.- 66.86,10.43 66.81,10.48 | 66.81,14.13 66.81,14.73 67.94,15.88 68.66,15.88 R26.2
N$30
  Top 0.305: IC7.7 15.78,25.49 15.02,26.25 14.61,26.66 14.61,31.11 14.61,31.15 14.7,31.25 15.33,31.88 16.45,31.88 X1.2 16.58,31.9 16.58,31.82 16.51,31.75 15.94,32.32 C21.1
N$31
  Top 0.406: IC1.4 36.17,9.62 R4.1
N$32
  Top 0.305: IC1.7 44.77,13.65 45.09,13.34 45.09,10.16 44.13,9.21 41.59,9.21 41.91,8.89 R32.1
N$33
  Top 0.305: 12.83,29.35 X1.4 | X1.4 12.78,29.43 11.58,30.62 11.58,30.64 11.43,30.79 11.43,32.98 11.58,33.12 12.55,33.12 C22.2 | IC7.8 13.14,25.81 12.9,26.05 X1.4
N$34
  Top 0.305: R33.2 94.31,15.86 94.61,15.24 94.61,11.58 Q7.3 95.57,11.43 96.52,10.48 99.69,10.48 C23.2
N$35
  Top 0.305: Q7.2 92.66,8.69 R34.1
N$37  (1 unrouted)
NVN$9
  Top 0.406: R8.1 R9.2
NVN$11
  Top 0.406: R6.1 R8.2
PULL  (via drill 0.9, 1)
  Top 0.305: 10.48,24.13 10.48,19.68 11.68,18.48 IC7.14 | PULL.1 C8.2
  Top 0.5: 10.48,24.13 v10.48,25.08 | v64.14,47.94 PULL.1 | PULL.1
  Bottom 0.5: v10.48,25.08 10.48,39.05 10.48,40.01 15.56,45.09 15.88,45.4 21.59,45.4 23.5,47.31 51.12,47.31 52.39,48.58 63.5,48.58 v64.14,47.94
PUSH  (via drill 0.9, 1)
  Top 0.305: IC7.13 11.98,19.29 11.91,19.36 11.27,20 11.27,22.79 11.27,23.02 v11.75,23.5 | PUSH.1 C4.2
  Top 0.5: v53.98,46.35 56.03,46.35 PUSH.1
  Bottom 0.5: v11.75,23.5 11.75,40.01 16.19,44.45 21.91,44.45 23.81,46.35 52.7,46.35 v53.98,46.35
RESET#
  Top 0.305: SL3.5 4.33,22.56 3.77,23.12 3.77,26.88 | 3.77,26.88 6.27,29.38 | 6.27,29.38 7.52,29.38 R15.1 | SW1.P$2 5.96,29.69 6.27,29.38 | 3.98,26.67 3.77,26.88 | IC7.29 17.38,20.09 10.79,26.67 3.98,26.67 | 3.98,26.67 3.81,26.67 3.98,26.67
RTCINT
  Top 0.25: 21.27,34.92 21.27,27.94
  Top 0.305: IC6.5 32.38,36.2 28.89,39.69 28.89,42.86 27.94,43.81 24.77,43.81 21.27,40.32 21.27,34.92 | IC7.32 22.02,22.54 21.91,22.54 21.91,26.35 21.27,26.99 21.27,27.94
RTCSEL#
  Top 0.25: 25.08,31.75 28.26,31.75 28.57,32.07 28.57,32.7 28.26,33.02 25.08,33.02 24.77,33.34 24.77,35.24 25.08,35.56 29.53,35.56 33.97,31.11 IC6.1
  Top 0.305: IC7.25 23.87,16.89 25.88,18.89 25.88,27.15 24.77,28.26 24.77,31.75 25.08,31.75
RTCVCC
  Top 0.305: IC6.4 37.47,34.92 37.47,29.53 36.2,28.26 | L2.2 36.2,28.26 | 36.83,27.3 36.76,27.38 C24.1 36.74,27.71 36.2,28.26
RXD
  Top 0.305: R37.2 20.25,38.34 20.25,41.98 16.83,45.4 COMRXD.1
SCK
  Top 0.305: SL3.4 6.27,20 4.39,20 3.77,19.38 3.77,16.88 4.39,16.25 9.39,16.25 9.47,16.25 11.11,14.61 14.29,14.61 14.92,15.24 14.92,15.34 IC7.17 14.98,16.89 15.24,17.14 20.32,17.14 21.59,15.88 26.99,15.88 | 26.99,15.88 26.99,31.28 IC6.20 | 26.99,15.88 28.89,13.97 34.92,13.97 35.24,13.65 IC1.2 | IC1.2 36.2,13.65 IC1.2
SW_LOW_A
  Top 0.5: 86.36,45.09 86.04,45.09 C14.2
  Top 0.6: Q2.D 79.38,45.4 79.69,45.09 86.04,45.09 | 86.36,45.09 88.21,45.09 TR1.1.BOTTOM.1
SW_LOW_B
  Top 0.5: 79.69,42.86 79.38,42.55 | C12.2 86.36,42.86
  Top 0.6: TR1.1.TOP.1 90,41.13 88.27,42.86 86.36,42.86 79.69,42.86 | 79.38,42.55 Q4.D
TXD
  Top 0.305: R38.2 19.37,31.43 19.05,31.75 19.05,39.69 19.05,41.91 15.56,45.4 15.56,47.94 15.88,48.26 18.1,48.26 COMTXD.1 19.37,44.45 20,44.45 | 20,44.45 R40.1 | R40.1 20.32,44.45 | R40.1 20,44.45
X+  (1 unrouted)
  Top 0.25: Q3.3 78.67,11.04 77.79,10.16 77.79,3.81 78.74,2.86
  Top 0.305: R17.2 78.68,15.63 78.68,14.24 Q3.3 | 78.74,2.86 89.53,2.86
X-  (1 unrouted)
  Top 0.25: 83.68,9.07 84.14,9.53 84.14,11.75 83.82,12.06 83.79,12.04 Q1.3 83.53,12.04 83.5,12.06 83.68,12.24 83.68,15.01 | 79.38,6.35 79.06,6.03 79.06,4.13 79.38,3.81
  Top 0.305: 83.68,15.01 84.31,15.63 84.71,15.63 R16.2 | 83.68,9.07 81.6,6.99 80.01,6.99 79.38,6.35 | 79.38,3.81 89.22,3.81
XDAC  (via drill 0.9, 1)
  Top 0.305: R32.2 40.65,3.81 47.31,11.11 47.31,14.29 v47.62,14.61 | C15.+ 88.67,13.43 v90.49,13.65
  Bottom 0.305: 89.53,14.61 v90.49,13.65
  Bottom 0.406: v47.62,14.61 89.53,14.61
Y+  (1 unrouted)
  Top 0.25: 59.05,14.29 59.03,14.29 Q6.3 58.98,1.35 59.37,0.95 77.79,0.95
  Top 0.305: R25.2 59.3,14.54 59.05,14.29 | 77.79,0.95 90.17,0.95
Y-  (2 unrouted)
  Top 0.25: 64.31,9.06 64.45,9.21 | 64.45,9.21 64.77,9.53 | 64.77,9.53 64.77,11.57 Q5.3 64.33,12.06 64.45,12.06 64.31,12.21 64.31,15.57 | 78.11,1.91 60.96,1.91 60.01,2.86 60.01,6.67 61.28,7.94 63.18,7.94 64.45,9.21 | 64.45,9.21 64.77,9.53
  Top 0.305: 64.31,15.57 64.64,15.91 65.6,15.91 65.6,15.68 65.56,15.63 | 78.11,1.91 89.85,1.91
YDAC  (via drill 1)
  Top 0.305: R4.2 34.4,2.75 34.61,2.54 34.92,2.22 43.5,2.22 48.58,7.94 v48.58,12.38 | v70.8,12.38 70.8,13.65 69.22,13.65 68.9,13.34 68.89,13.34 C18.+
  Bottom 0.305: 69.85,12.38 v70.8,12.38
  Bottom 0.406: v48.58,12.38 69.85,12.38
ZDAC
  Top 0.25: 33.97,13.02 38.1,13.02
  Top 0.305: IC7.24 20.73,14.92 24.77,14.92 26.67,13.02 33.97,13.02 | 38.1,13.02 38.1,15.88 35.56,15.88 35.24,16.19 35.24,21.91 36.83,23.5 38.73,23.5 | 38.73,23.5 R35.1 | R35.1 39.05,23.5 38.73,23.5 | R35.1 38.73,23.5
ZDACN$36  (via drill 0.9, 1)
  Top 0.305: R35.2 40.96,23.5 R35.2 | v92.39,15.24 92.39,14.92 92.39,12.65 Q7.1 | R35.2 43.97,23.5 v50.16,17.3
  Bottom 0.305: 50.8,16.67 70.33,16.67 70.8,16.19 73.66,16.19 73.98,16.51 89.53,16.51 90.81,15.24
  Bottom 0.406: 90.81,15.24 v92.39,15.24 | 50.8,16.67 v50.16,17.3
(copper drawn outside any net)
  shapes: Top area x313

### Text on the board
Top: 2012